# EAGLE schematic ge7 (EAGLE 8.5.1)
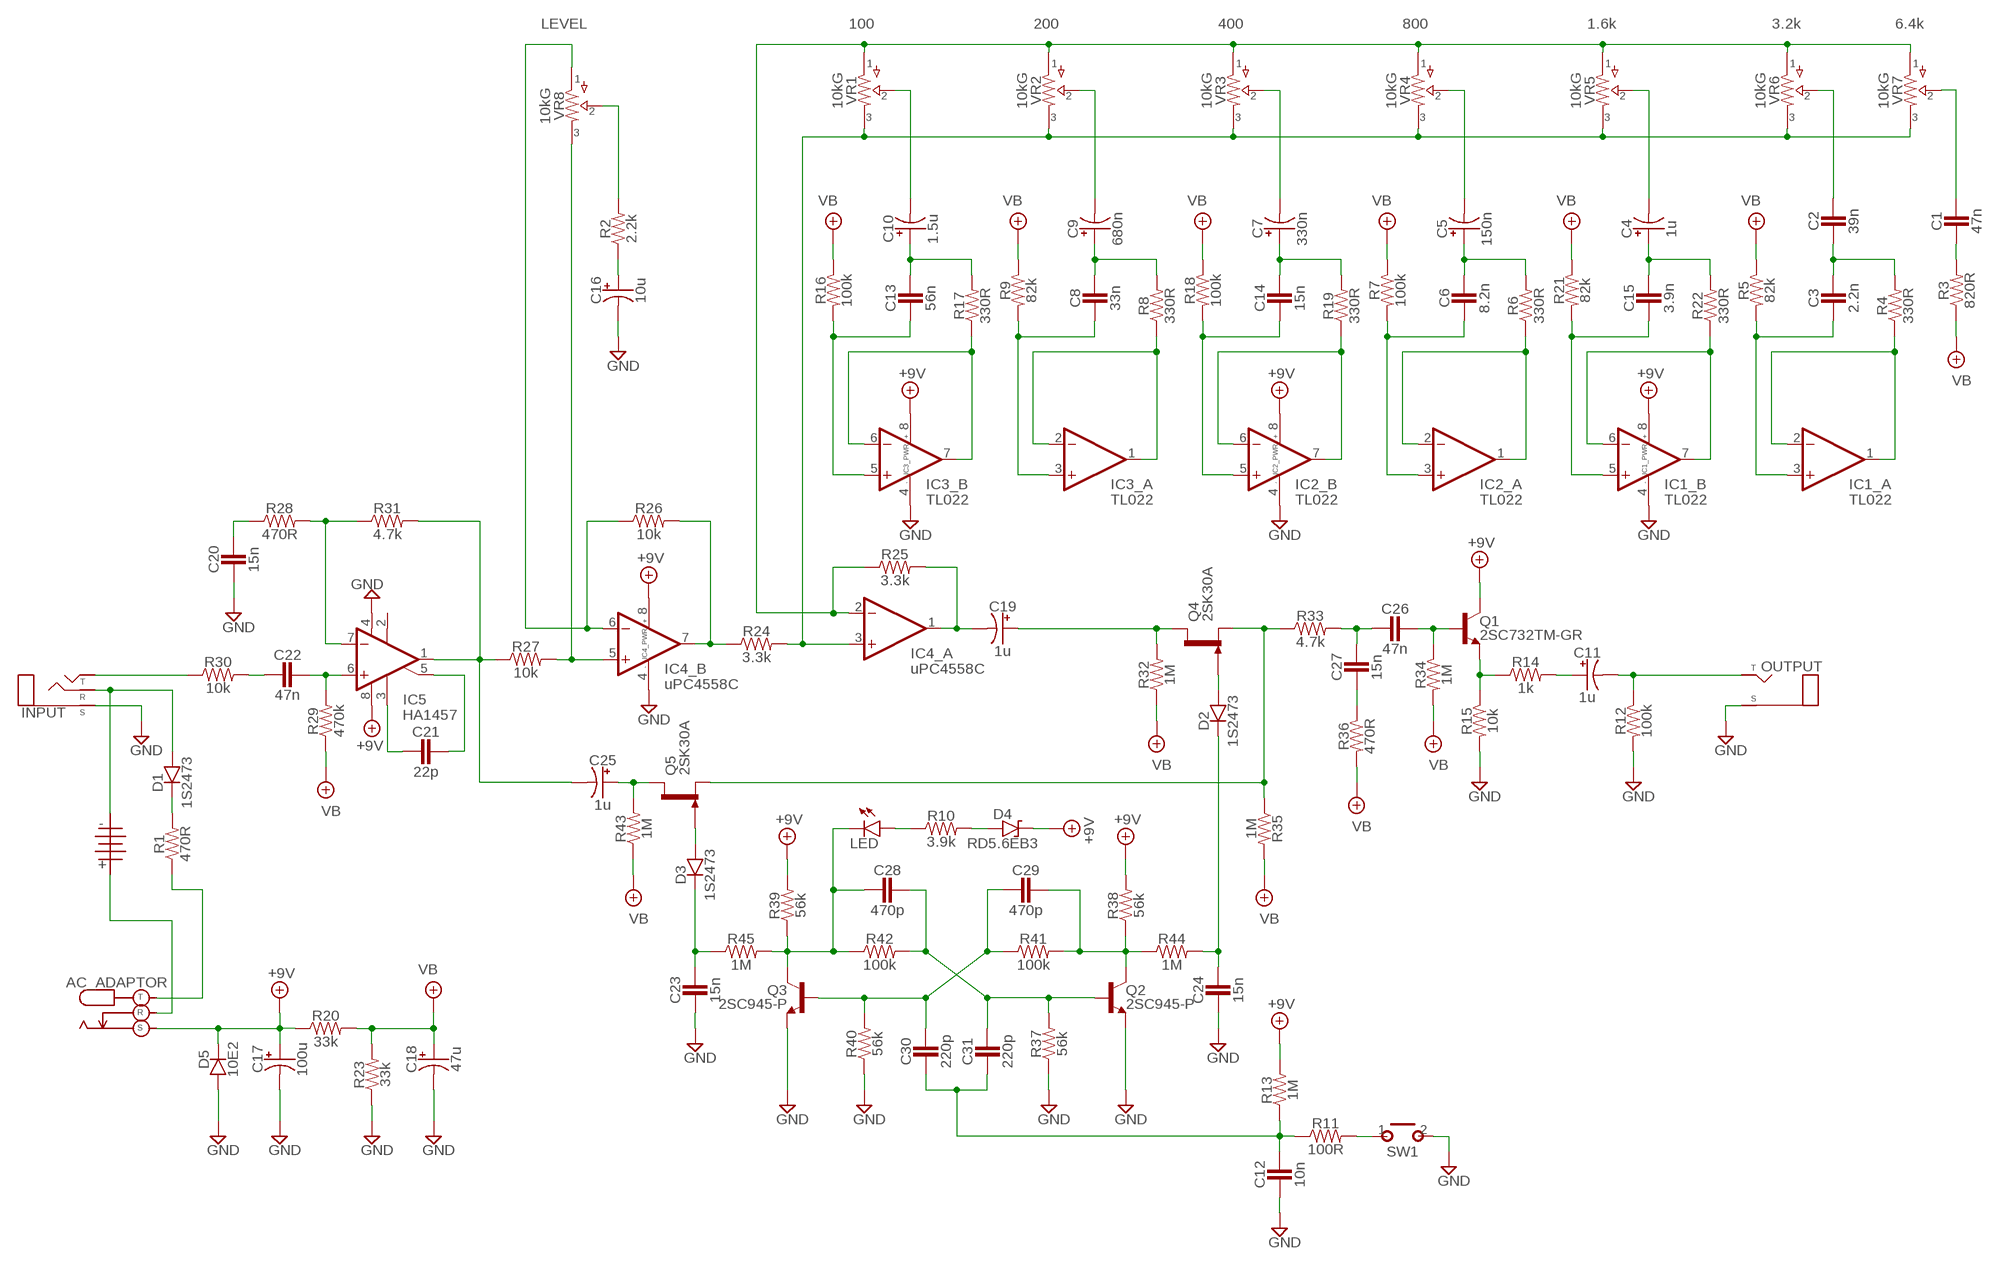
[diagram p0: schematic, sheet 1]

## Parts
AC_ADAPTOR  DC_KOBICONN  [DC_KOBICONN]
BATTERY  BATTERY  [TWO_PADS]
C1  47n  CER/FILMBOX.1  [BOX_SMALL]
C2  39n  CER/FILMBOX.1  [BOX_SMALL]
C3  2.2n  CER/FILMBOX.1  [BOX_SMALL]
C4  1u  0400  [040_020]
C5  150n  0400  [040_020]
C6  8.2n  CER/FILMBOX.1  [BOX_SMALL]
C7  330n  0400  [040_020]
C8  33n  CER/FILMBOX.1  [BOX_SMALL]
C9  680n  0400  [040_020]
C10  1.5u  0400  [040_020]
C11  1u  0400  [040_020]
C12  10n  CER/FILMBOX.1  [BOX_SMALL]
C13  56n  CER/FILMBOX.1  [BOX_SMALL]
C14  15n  CER/FILMBOX.1  [BOX_SMALL]
C15  3.9n  CER/FILMBOX.1  [BOX_SMALL]
C16  10u  0400  [040_020]
C17  100u  0400  [040_020]
C18  47u  0400  [040_020]
C19  1u  0400  [040_020]
C20  15n  CER/FILMBOX.1  [BOX_SMALL]
C21  22p  CER/FILMBOX.1  [BOX_SMALL]
C22  47n  CER/FILMBOX.1  [BOX_SMALL]
C23  15n  CER/FILMBOX.1  [BOX_SMALL]
C24  15n  CER/FILMBOX.1  [BOX_SMALL]
C25  1u  0400  [040_020]
C26  47n  CER/FILMBOX.1  [BOX_SMALL]
C27  15n  CER/FILMBOX.1  [BOX_SMALL]
C28  470p  CER/FILMBOX.1  [BOX_SMALL]
C29  470p  CER/FILMBOX.1  [BOX_SMALL]
C30  220p  CER/FILMBOX.1  [BOX_SMALL]
C31  220p  CER/FILMBOX.1  [BOX_SMALL]
D1  1S2473  DO35.2  [DO35-2]
D2  1S2473  DO35.2  [DO35-2]
D3  1S2473  DO35.2  [DO35-2]
D4  RD5.6EB3  ZENER.2  [DO41-2]
D5  10E2  DO35.2  [DO35-2]
IC1  TL022  DUALTH  [DIL0]
IC2  TL022  DUALTH  [DIL0]
IC3  TL022  DUALTH  [DIL0]
IC4  uPC4558C  DUALTH  [DIL0]
IC5  HA1457  [SIL8]
INPUT  STEREO3PADS  [THREEPADS]
LED  LED  [3MM_D]
OUTPUT  MONO  [TWO_PADS]
Q1  2SC732TM-GR  2SC828A  [TO92-]
Q2  2SC945-P  2SC828A  [TO92-]
Q3  2SC945-P  2SC828A  [TO92-]
Q4  2SK30A  2N5457  [TO92-]
Q5  2SK30A  2N5457  [TO92-]
R1  470R  R_.3B  [R0207/3]
R2  2.2k  R_.3B  [R0207/3]
R3  820R  R_.3B  [R0207/3]
R4  330R  R_.3B  [R0207/3]
R5  82k  R_.3B  [R0207/3]
R6  330R  R_.3B  [R0207/3]
R7  100k  R_.3B  [R0207/3]
R8  330R  R_.3B  [R0207/3]
R9  82k  R_.3B  [R0207/3]
R10  3.9k  R_.3B  [R0207/3]
R11  100R  R_.3B  [R0207/3]
R12  100k  R_.3B  [R0207/3]
R13  1M  R_.3B  [R0207/3]
R14  1k  R_.3B  [R0207/3]
R15  10k  R_.3B  [R0207/3]
R16  100k  R_.3B  [R0207/3]
R17  330R  R_.3B  [R0207/3]
R18  100k  R_.3B  [R0207/3]
R19  330R  R_.3B  [R0207/3]
R20  33k  R_.3B  [R0207/3]
R21  82k  R_.3B  [R0207/3]
R22  330R  R_.3B  [R0207/3]
R23  33k  R_.3B  [R0207/3]
R24  3.3k  R_.3B  [R0207/3]
R25  3.3k  R_.3B  [R0207/3]
R26  10k  R_.3B  [R0207/3]
R27  10k  R_.3B  [R0207/3]
R28  470R  R_.3B  [R0207/3]
R29  470k  R_.3B  [R0207/3]
R30  10k  R_.3B  [R0207/3]
R31  4.7k  R_.3B  [R0207/3]
R32  1M  R_.3B  [R0207/3]
R33  4.7k  R_.3B  [R0207/3]
R34  1M  R_.3B  [R0207/3]
R35  1M  R_.3B  [R0207/3]
R36  470R  R_.3B  [R0207/3]
R37  56k  R_.3B  [R0207/3]
R38  56k  R_.3B  [R0207/3]
R39  56k  R_.3B  [R0207/3]
R40  56k  R_.3B  [R0207/3]
R41  100k  R_.3B  [R0207/3]
R42  100k  R_.3B  [R0207/3]
R43  1M  R_.3B  [R0207/3]
R44  1M  R_.3B  [R0207/3]
R45  1M  R_.3B  [R0207/3]
SW1  MOMENTARY  [SPST]
VR1  10kG  POTS16MM  [16MM]
VR2  10kG  POTS16MM  [16MM]
VR3  10kG  POTS16MM  [16MM]
VR4  10kG  POTS16MM  [16MM]
VR5  10kG  POTS16MM  [16MM]
VR6  10kG  POTS16MM  [16MM]
VR7  10kG  POTS16MM  [16MM]
VR8  10kG  POTS16MM  [16MM]

## Nets
+9V: AC_ADAPTOR.S C17.+ D4.C D5.C IC1.8(_PWR:V+) IC2.8(_PWR:V+) IC3.8(_PWR:V+) IC4.8(_PWR:V+) IC5.8(V+) Q1.2(C) R13.2 R20.1 R38.2 R39.2
GND: C12.2 C16.- C17.- C18.- C20.2 C23.2 C24.2 D5.A IC1.4(_PWR:V-) IC2.4(_PWR:V-) IC3.4(_PWR:V-) IC4.4(_PWR:V-) IC5.4(V-) INPUT.SLEEVE(S) OUTPUT.S(SLEEVE) Q2.3(E) Q3.3(E) R12.2 R15.2 R23.1 R37.1 R40.1 SW1.2(S)
N$1: C21.2 IC5.3(ON1)
N$2: BATTERY.S D1.A INPUT.RING(R)
N$3: C21.1 IC5.5(ON2)
N$4: INPUT.TIP(T) R30.1
N$5: C22.2 R30.2
N$6: C22.1 IC5.6(+IN) R29.2
N$7: IC5.7(-IN) R28.2 R31.1
N$8: C25.- IC5.1(OUT) R27.1 R31.2
N$9: C20.1 R28.1
N$10: IC4.6(_B:-IN) R26.1 VR8.1
N$11: IC4.7(_B:OUT) R24.1 R26.2
N$12: IC4.5(_B:+IN) R27.2 VR8.3
N$13: IC4.3(_A:+IN) R24.2 VR1.3 VR2.3 VR3.3 VR4.3 VR5.3 VR6.3 VR7.3
N$14: IC4.2(_A:-IN) R25.1 VR1.1 VR2.1 VR3.1 VR4.1 VR5.1 VR6.1 VR7.1
N$15: C19.- IC4.1(_A:OUT) R25.2
N$16: R2.2 VR8.2
N$17: C16.+ R2.1
N$18: IC3.6(_B:-IN) IC3.7(_B:OUT) R17.1
N$19: C13.2 IC3.5(_B:+IN) R16.2
N$20: C10.+ C13.1 R17.2
N$21: C10.- VR1.2
N$22: C19.+ Q4.3(D) R32.2
N$23: C25.+ Q5.3(D) R43.2
N$24: IC3.1(_A:OUT) IC3.2(_A:-IN) R8.1
N$25: C8.2 IC3.3(_A:+IN) R9.2
N$26: C8.1 C9.+ R8.2
N$27: AC_ADAPTOR.R BATTERY.T
N$28: AC_ADAPTOR.T R1.1
N$29: C28.2 LED.P$1(C) Q3.2(C) R39.1 R42.1 R45.2
N$30: D1.C R1.2
N$31: C29.1 Q2.2(C) R38.1 R41.2 R44.1
N$32: C29.2 C30.1 Q3.1(B) R40.2 R41.1
N$33: C9.- VR2.2
N$34: C28.1 C31.1 Q2.1(B) R37.2 R42.2
N$35: D3.A Q5.1(G)
N$36: C12.1 C30.2 C31.2 R11.1 R13.1
N$37: D2.A Q4.1(G)
N$38: IC2.6(_B:-IN) IC2.7(_B:OUT) R19.1
N$39: C14.2 IC2.5(_B:+IN) R18.2
N$40: C7.+ C14.1 R19.2
N$41: C7.- VR3.2
N$42: Q4.2(S) Q5.2(S) R33.1 R35.1
N$43: C26.2 C27.1 R33.2
N$44: IC2.1(_A:OUT) IC2.2(_A:-IN) R6.1
N$45: C6.2 IC2.3(_A:+IN) R7.2
N$46: C5.+ C6.1 R6.2
N$47: C5.- VR4.2
N$48: C27.2 R36.1
N$49: C26.1 Q1.1(B) R34.1
N$50: IC1.6(_B:-IN) IC1.7(_B:OUT) R22.1
N$51: C15.2 IC1.5(_B:+IN) R21.2
N$52: C4.+ C15.1 R22.2
N$53: C4.- VR5.2
N$54: Q1.3(E) R14.1 R15.1
N$55: C11.+ R14.2
N$56: IC1.1(_A:OUT) IC1.2(_A:-IN) R4.1
N$57: C3.2 IC1.3(_A:+IN) R5.2
N$58: C2.2 C3.1 R4.2
N$59: C2.1 VR6.2
N$60: C1.2 R3.2
N$61: C1.1 VR7.2
N$62: C11.- OUTPUT.T(TIP) R12.1
N$63: C23.1 D3.C R45.1
N$64: C24.1 D2.C R44.2
N$65: R11.2 SW1.1(P)
N$66: LED.ANODE(A) R10.1
N$67: D4.A R10.2
VB: C18.+ R3.1 R5.1 R7.1 R9.1 R16.1 R18.1 R20.2 R21.1 R23.2 R29.1 R32.1 R34.2 R35.2 R36.2 R43.1
Unconnected: IC5.2(OPT)

## Notes on the sheet
- LEVEL | 100 | 200 | 400 | 800 | 1.6k | 3.2k | 6.4k

## Library data of the parts
AC_ADAPTOR = pedals-jacks:DC_KOBICONN
BATTERY = pedals-jacks:BATTERY
C1-C3 C6 C8 C12-C15 C20-C24 C26-C31 = pedals-capacitors-film:CER/FILM: 47 - 120pF Xicon Ceramic Disc 2.5mm lead spacing
C4 C5 C7 C9-C11 C16-C19 C25 = pedals-capacitors-elec:040
D1-D3 D5 = pedals-diodes:DO35: DO-35 Package Diodes: 1N914
D4 = pedals-diodes:ZENER
IC1-IC4 = pedals-integrated circuits:DUAL: OP AMP
IC5 = pedals-integrated circuits:HA1457
INPUT = pedals-jacks:STEREO
LED = pedals-diodes:LED
OUTPUT = pedals-jacks:MONO: Mono 1/4" Phone Jack
Q1-Q3 = pedals-transistors:2SC828A
Q4 Q5 = pedals-transistors:2N5457: N-CHANNEL JFET
R1-R45 = pedals-resistors:R_
SW1 = pedals-switches:MOMENTARY
VR1-VR8 = pedals-potentiometers:POTS